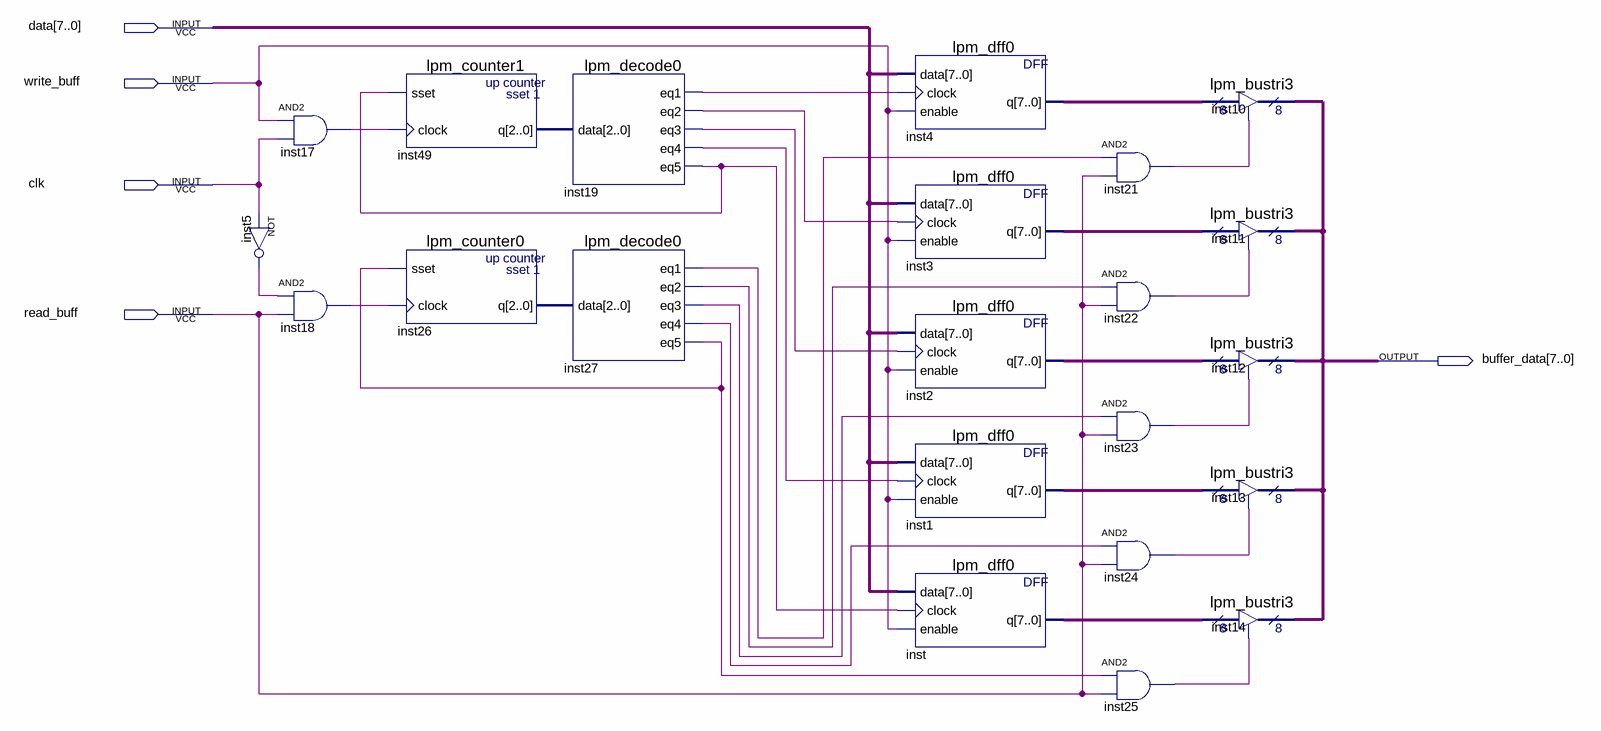
[diagram p0: schematic sheet]
// Quartus schematic bufferBlock.bdf as structural Verilog: 22 symbols, 5 pins
module bufferBlock (
  input  [7:0] data,
  input  write_buff,
  input  clk,
  input  read_buff,
  output [7:0] buffer_data
);

  wire inst5_out, inst17_out, inst18_out, inst19_eq1, inst19_eq2, inst19_eq3, inst19_eq4, inst19_eq5,
       inst21_out, inst22_out, inst23_out, inst24_out, inst25_out, inst27_eq1, inst27_eq2, inst27_eq3,
       inst27_eq4, inst27_eq5;
  wire [2:0] inst26_q, inst49_q;
  wire [7:0] inst1_q, inst2_q, inst3_q, inst4_q, inst_q;

  not inst5 (inst5_out, clk);
  and inst17 (inst17_out, write_buff, clk);
  and inst18 (inst18_out, inst5_out, read_buff);
  lpm_counter1 inst49 (.sset(inst19_eq5), .clock(inst17_out), .q(inst49_q));
  lpm_counter0 inst26 (.sset(inst27_eq5), .clock(inst18_out), .q(inst26_q));
  lpm_decode0 inst19 (
    .data(inst49_q), .eq1(inst19_eq1), .eq2(inst19_eq2), .eq3(inst19_eq3), .eq4(inst19_eq4), .eq5(inst19_eq5));
  lpm_decode0 inst27 (
    .data(inst26_q), .eq1(inst27_eq1), .eq2(inst27_eq2), .eq3(inst27_eq3), .eq4(inst27_eq4), .eq5(inst27_eq5));
  lpm_dff0 inst4 (.data(data), .clock(inst19_eq1), .enable(write_buff), .q(inst4_q));
  lpm_dff0 inst3 (.data(data), .clock(inst19_eq2), .enable(write_buff), .q(inst3_q));
  lpm_dff0 inst2 (.data(data), .clock(inst19_eq3), .enable(write_buff), .q(inst2_q));
  lpm_dff0 inst1 (.data(data), .clock(inst19_eq4), .enable(write_buff), .q(inst1_q));
  lpm_dff0 inst (.data(data), .clock(inst19_eq5), .enable(write_buff), .q(inst_q));
  and inst21 (inst21_out, inst27_eq1, read_buff);
  and inst22 (inst22_out, inst27_eq2, read_buff);
  and inst23 (inst23_out, inst27_eq3, read_buff);
  and inst24 (inst24_out, inst27_eq4, read_buff);
  and inst25 (inst25_out, inst27_eq5, read_buff);
  lpm_bustri3 inst10 (.enabledt(inst21_out), .data(inst4_q), .tridata(buffer_data));
  lpm_bustri3 inst11 (.enabledt(inst22_out), .data(inst3_q), .tridata(buffer_data));
  lpm_bustri3 inst12 (.enabledt(inst23_out), .data(inst2_q), .tridata(buffer_data));
  lpm_bustri3 inst13 (.enabledt(inst24_out), .data(inst1_q), .tridata(buffer_data));
  lpm_bustri3 inst14 (.enabledt(inst25_out), .data(inst_q), .tridata(buffer_data));
endmodule
